# EasyEDA schematic PWM fan temperature regulator.json
TITLE: Main board; REV: 1.2; Date: 2021-10-24; Sheet: 1/1; Drawn By: Doswiadczalnik; Company: Doświadczalnik
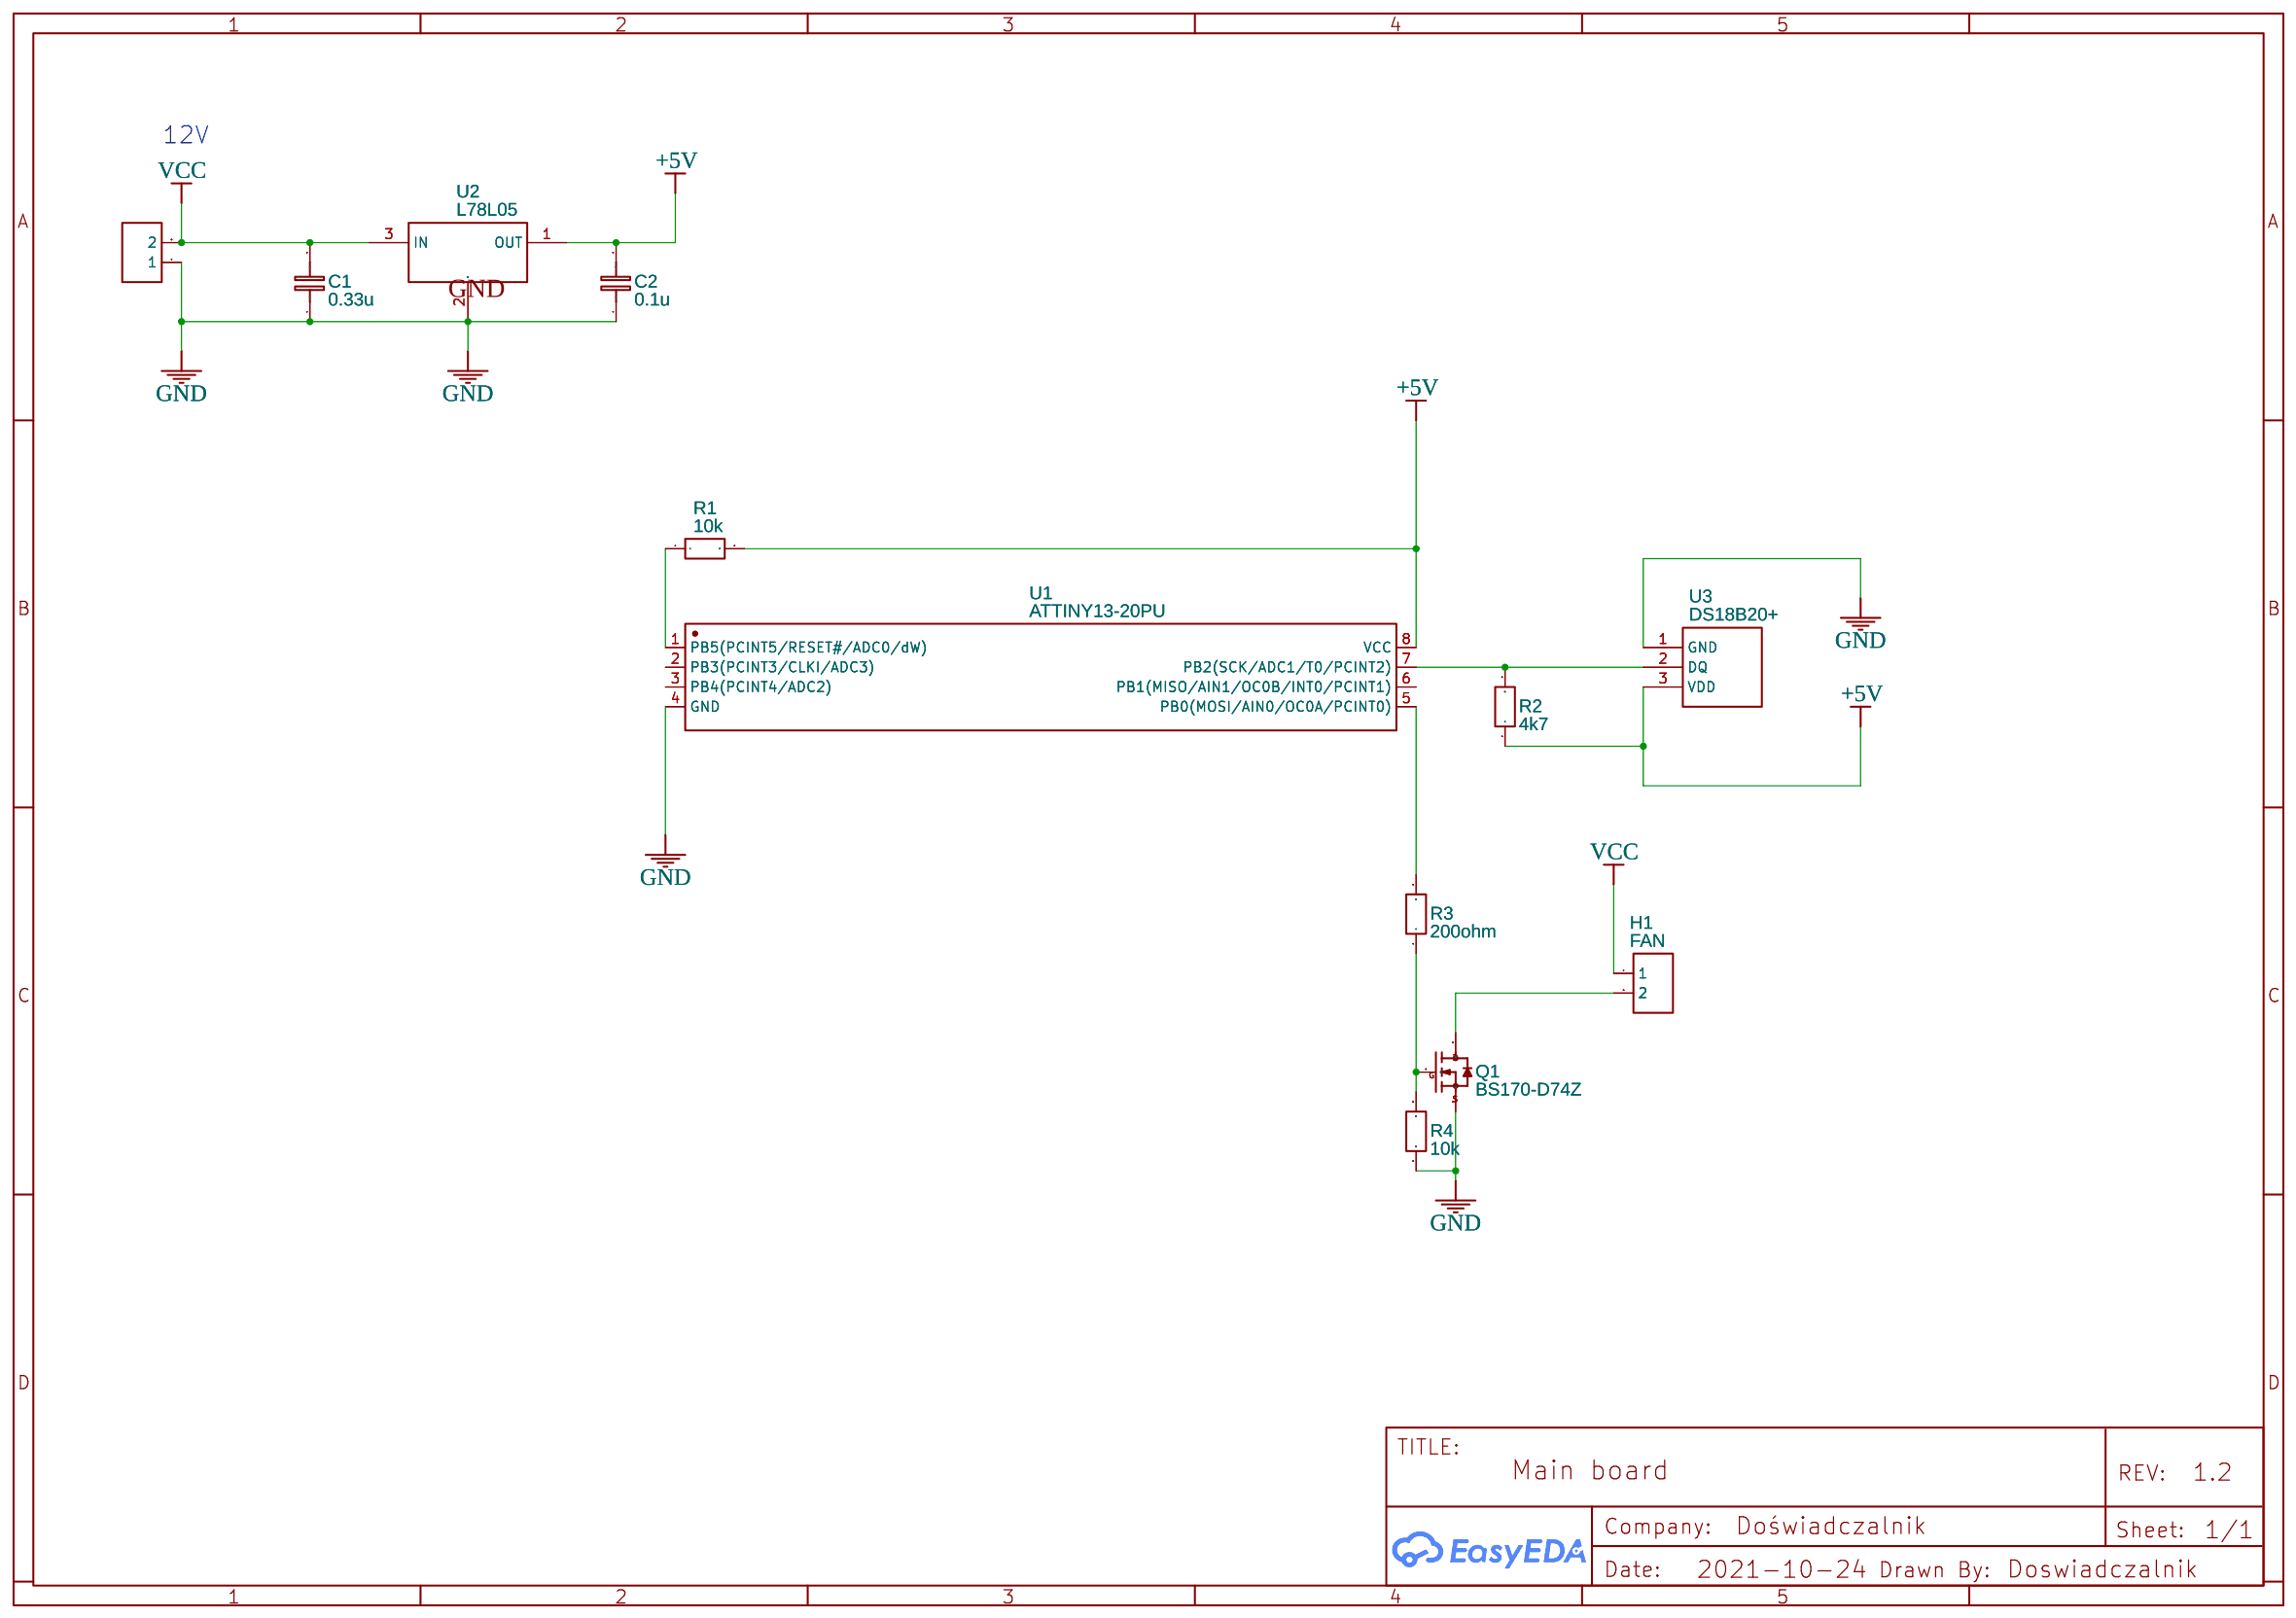
[diagram p0: schematic sheet]

## Parts
C1  0.33u  [C0603]
C2  0.1u  [C0603]
H1  FAN  [HDR-F-2.54_1X2]
H2  HDR-F-2.54_1x2  [HDR-F-2.54_1X2]
Q1  BS170-D74Z  [TO-92-3_L4.9-W3.7-P1.27-L]
R1  10k  [R0603]
R2  4k7  [R0603]
R3  200ohm  [R0603]
R4  10k  [R0603]
U1  ATTINY13-20PU  [DIP-8_L9.2-W6.4-P2.54-LS8.7-BL]
U2  L78L05  [TO-92-3_L4.8-W3.7-P2.54-L]
U3  DS18B20+  [TO-92-3_L4.9-W3.7-P1.27-L]

## Library data of the parts
C1 C2 = C_0603_EU: Contributor: LCEDA_Lib
H1 H2 = HDR-F-2.54_1x2: Supplier Part: C49661; Supplier: LCSC; Contributor: LCEDA_Lib
Q1 = BS170-D74Z: Supplier: LCSC; Supplier Part: C900827; Manufacturer: ON(安森美); JLCPCB Part Class: Extended Part; Contributor: LCSC
R1-R4 = R_0603_EU: Contributor: LCEDA_Lib
U1 = ATTINY13-20PU: Supplier: LCSC; Manufacturer: MICROCHIP; Contributor: LCSC; Supplier Part: C145757; JLCPCB Part Class: Extended Part
U2 = L78L05ACZTR: Supplier: LCSC; Manufacturer: STMicroelectronics; Supplier Part: C118270; JLCPCB Part Class: Extended Part
U3 = DS18B20+: Supplier: LCSC; Manufacturer: MAXIM; Supplier Part: C9753; JLCPCB Part Class: Extended Part

## Nets
+5V: C2.2 R1.2 R2.1 U1.8(VCC) U2.1(OUT) U3.3(VDD)
GND: C1.1 C2.1 H2.1 Q1.3(S) R4.1 U1.4(GND) U2.2(GND) U3.1(GND)
VCC: C1.2 H1.1 H2.2 U2.3(IN)
Net-(H1-2): H1.2 Q1.1(D)
Net-(Q1-2): Q1.2(G) R3.1 R4.2
Net-(R1-1): R1.1 U1.1(PB5(PCINT5/RESET#/ADC0/dW))
Net-(R2-2): R2.2 U1.7(PB2(SCK/ADC1/T0/PCINT2)) U3.2(DQ)
Net-(R3-2): R3.2 U1.5(PB0(MOSI/AIN0/OC0A/PCINT0))

Not connected (* = marked no-connect by the designer): U1 2(PB3(PCINT3/CLKI/ADC3)) 3(PB4(PCINT4/ADC2)) 6(PB1(MISO/AIN1/OC0B/INT0/PCINT1))

## Notes on the sheet
- 12V
